# EAGLE board GBA SP schematic (EAGLE 7.6.0), part 1 of 2
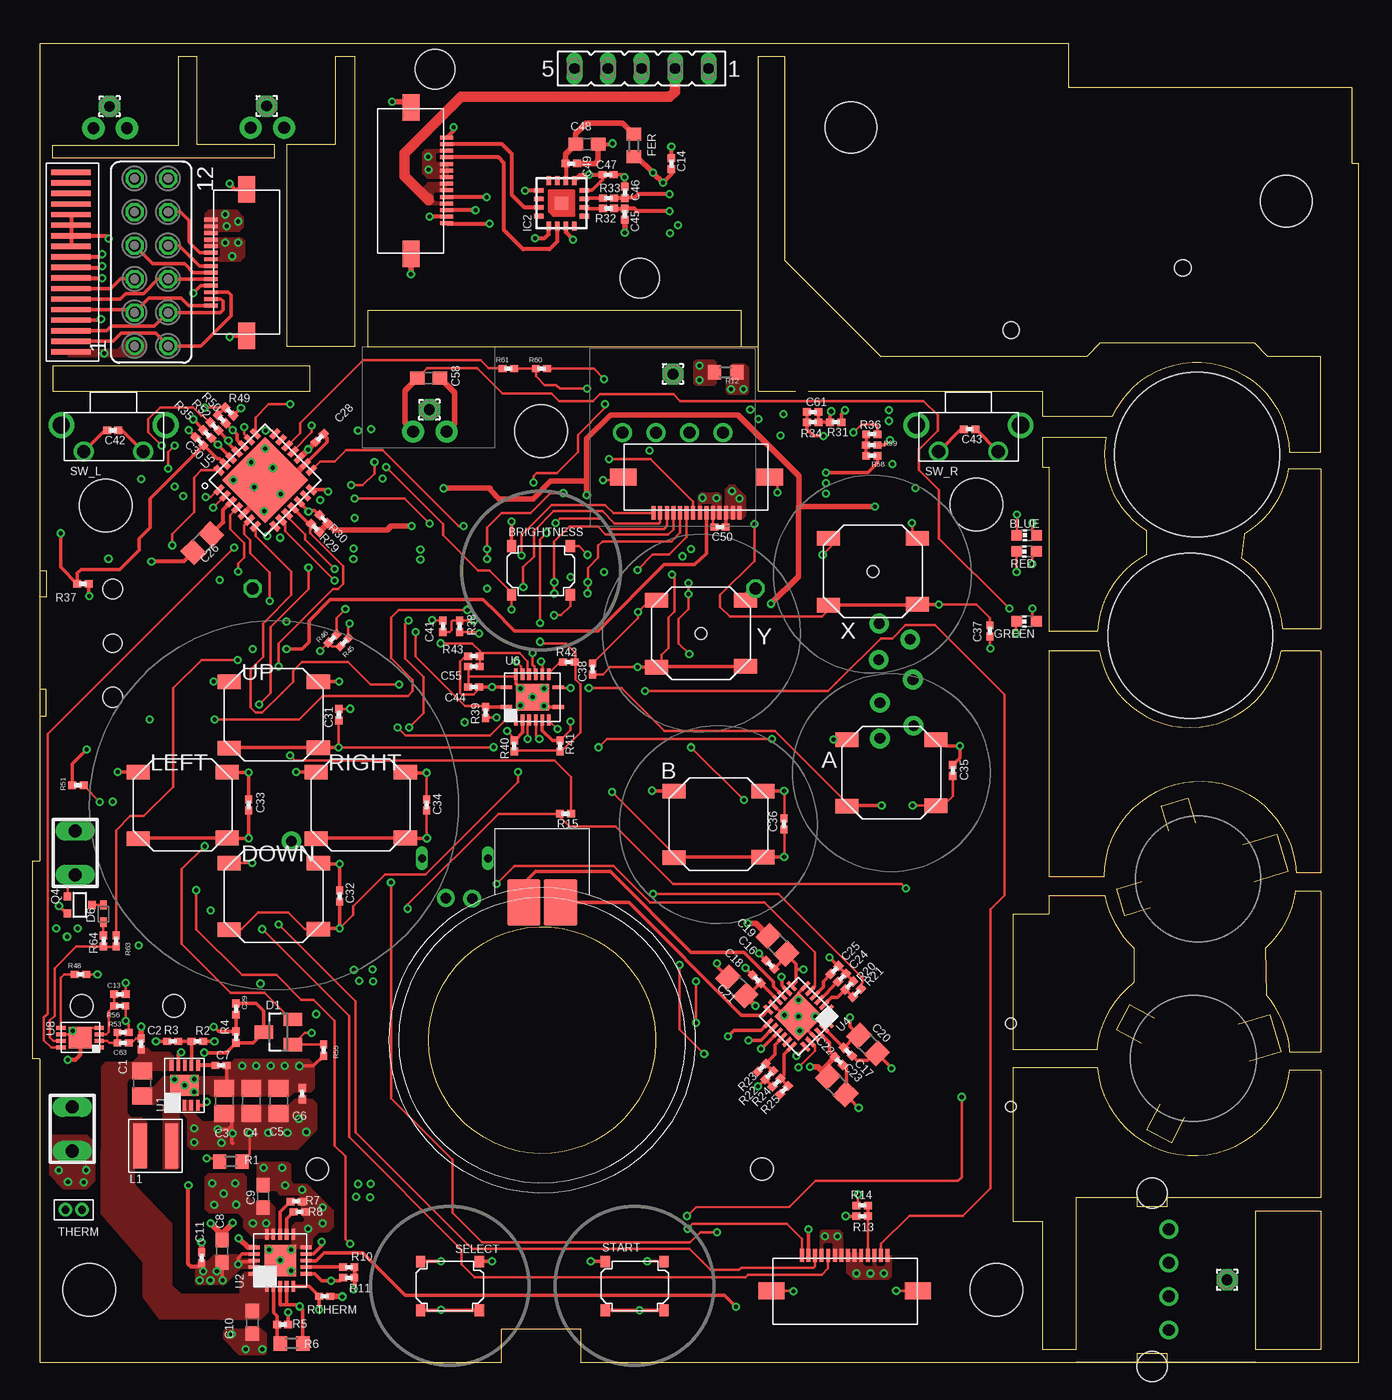
[diagram p10: board, top side]
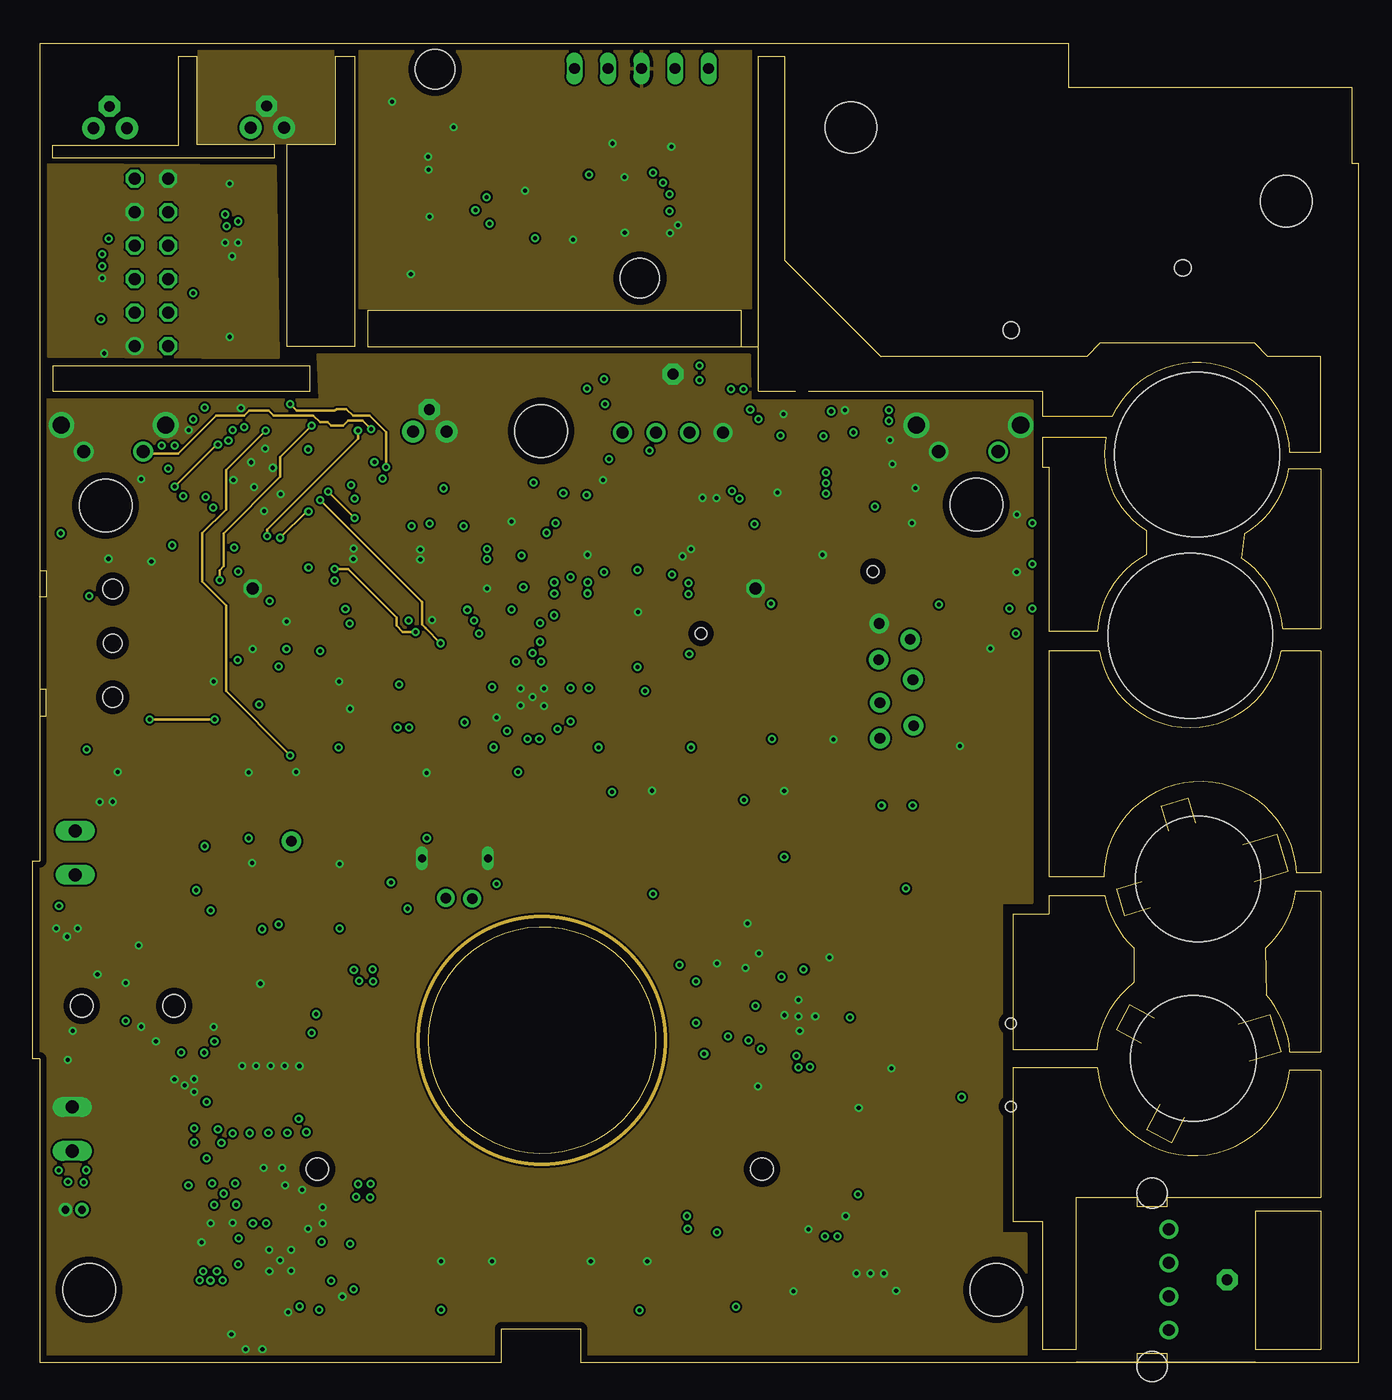
[diagram p11: board, inner layer Route2]
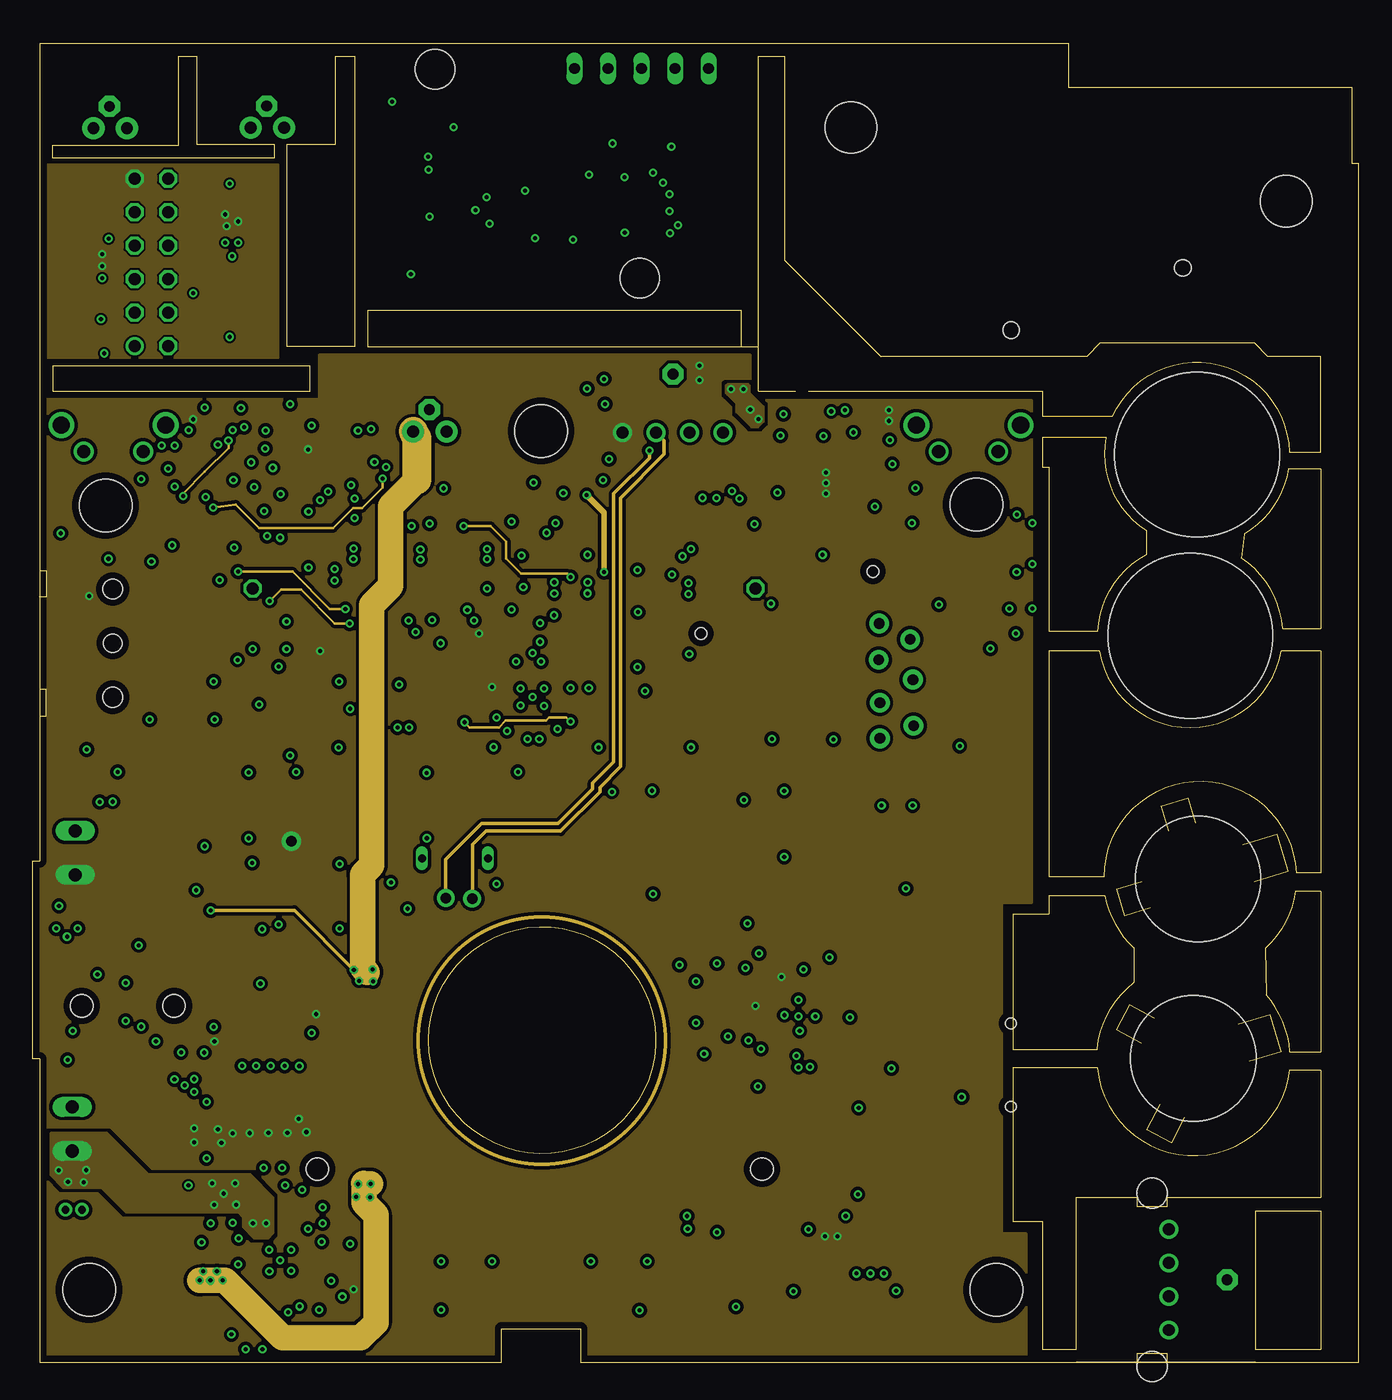
[diagram p12: board, inner layer Route15]
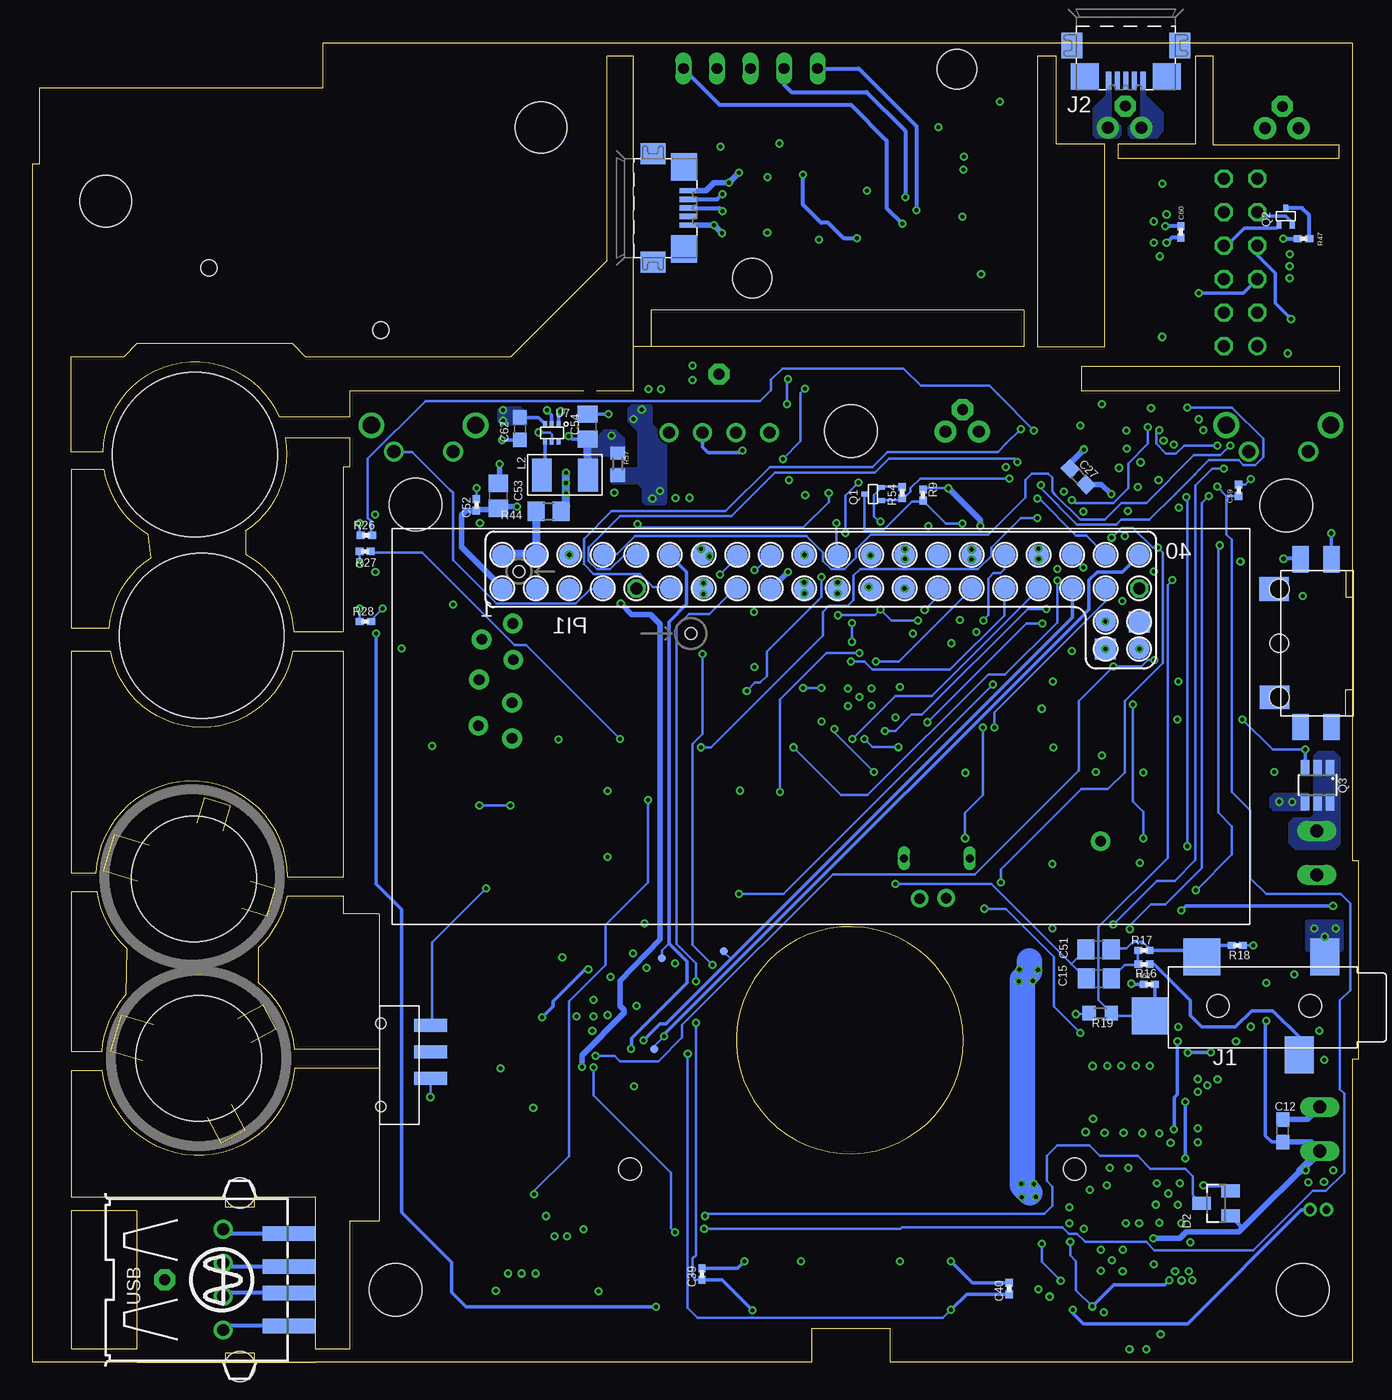
[diagram p13: board, bottom side, seen from below]

Size 100.5 x 100 mm. Coordinates in mm from the lower left corner, seen from the top.
Outline: 92.64,0 79.07,0
Outline: 0.5,0 35.5,0 35.5,2.55 41.5,2.55 41.5,0 100.5,0 100.5,90.85 100,90.85 100,96.6 78.5,96.6 78.5,100 0.5,100 0.5,38 0,38 0,23 0.5,23 0.5,0
Copper layers (1*2*15*16): Top 0.035mm / dielectric 0.2mm / Route2 0.035mm / dielectric 1.2mm / Route15 0.035mm / dielectric 0.2mm / Bottom 0.035mm
Design rules "Elecrow_4-layer_PCB_eagle_rule *": minimum track width 8mil, minimum drill 12mil, track to track 6mil, track to pad 6mil, pad to pad 6mil, via to via 8mil, smd to smd 0mil, copper to edge 20mil, drill to drill 10mil, minimum pad ring 6mil, minimum via ring 6mil, stop-mask expansion 0mil, vias tented up to drill 100mil, thermal gap 10mil
Holes 4 mm at 71.49,65.02 73.01,5.5 4.25,5.5 5.5,64.95 38.5,70.6
Holes 1.7 mm at 21.55,14.65 55.25,14.65
Holes 0.9 mm at 63.66,59.95 50.63,55.25
Holes 9.5 mm at 88.3,36.65 87.94,23.05
Holes 12.5 mm at 87.71,55.07 88.23,68.81
Holes 3.9 mm at 94.99,88.02 62,93.6
Holes 1.25 mm at 87.16,82.95 74.13,78.25
Holes 3 mm at 45.99,82.19 30.49,98.01
bKeepout: area 25,69.2 to 35,77; area 42.2,63.4 to 54.7,77
Milling: 128 lines

## Footprints (pad centres in the part's own frame; a part is rotated, then mirrored left to right if it is on the bottom)
GBA_SP_TACT = smd 1.75 x 1.1: 1 -3.37,2.5; 2 -3.37,-2.55; 3 3.38,2.5; 4 3.38,-2.5
HEADER-1X2 = drill 1 long: 1 -1.67,0; 2 1.67,0
CHIP-LED0603 = smd 0.8 x 0.8: A 0,-0.75; C 0,0.75
TL3315 = smd 0.7 x 0.9: 1 -2.225,1.85; 2 2.225,1.85; 3 -2.225,-1.85; 4 2.225,-1.85
C0805 = smd 1.3 x 1.5: 1 -0.95,0; 2 0.95,0
0402_REAL = smd 0.6 x 0.55: 1 -0.43,0.01; 2 0.42,0.01
C0603 = smd 1.1 x 1: 1 -0.85,0; 2 0.85,0
SOT23 = smd 1 x 1.4: 1 -0.95,-1.1; 2 0.95,-1.1; 3 0,1.1
SOD523 = smd 0.7 x 0.5: A 0.7,0; C -0.6,0
R0603 = smd 1 x 1.1: 1 -0.85,0; 2 0.85,0
QFN16 = smd 0.7 x 0.35: 1 -1.725,0.975; 2 -1.725,0.325; 3 -1.725,-0.325; 4 -1.725,-0.975; 9 1.725,-0.975; 10 1.725,-0.325; 11 1.725,0.325; 12 1.725,0.975 | smd 0.35 x 0.7: 5 -0.975,-1.725; 6 -0.325,-1.725; 7 0.325,-1.725; 8 0.975,-1.725; 13 0.975,1.725; 14 0.325,1.725; 15 -0.325,1.725; 16 -0.975,1.725 | smd 1 x 1: TAB 0,0
HEADPHONE_JACK = smd 2.2 x 2.8: 1 -4.64,-3.66; 3 -2.7,3.74 | smd 2.8 x 2.8: 2 4.69,-3.67; 4 8.59,0.79 | hole 1.7: -3.54,0.04; 3.46,0.04
MICRO_USB = smd 0.4 x 1.35: 1 -1.3,2.675; 2 -0.65,2.675; 3 0,2.675; 4 0.65,2.675; 5 1.3,2.675 | smd 1.6 x 1.9: M1 4.1,0; M2 -4.1,0 | smd 2.1 x 2: M3 -3.1,2.35; M4 3.1,2.35
USB_PWR_2PIN = drill 0.9 pad 1.676: 1 -1.27,0; 2 1.27,0
USB_4PIN = drill 0.9 pad 1.422: 1 -3.81,0; 2 -1.27,0; 3 1.27,0; 4 3.81,0
FPC_14 = smd 0.3 x 1: 1 -3.25,0; 2 -2.75,0; 3 -2.25,0; 4 -1.75,0; 5 -1.25,0; 6 -0.75,0; 7 -0.25,0; 8 0.25,0; 9 0.75,0; 10 1.25,0; 11 1.75,0; 12 2.25,0; 13 2.75,0; 14 3.25,0 | smd 2 x 1.3: PAD1 -5.55,-2.7; PAD2 5.55,-2.7
XFL4020-102MEB = smd 1 x 3.4: 1 -1.2,0; 2 1.2,0
L2520 = smd 1.5 x 2.5: 1 -0.5,0; 2 3,0
1,6/0,8 = drill 0.813 pad 1.6 octagon: 1 0,0
PI-ZERO = smd 1.6 x 1.6 bottom: 3.3V_1 56.64,25.45; 3.3V_2 36.3,25.45; 5V_1 56.64,27.99; 5V_2 54.07,27.99; BCM0 23.59,25.46; BCM1 23.61,28.01; BCM2_SDA 54.08,25.44; BCM3_SCL 51.55,25.45; BCM4 48.99,25.47; BCM5 21.07,25.47; BCM6 18.52,25.47; BCM7 26.14,28.01; BCM8 28.68,28; BCM9 31.22,25.45; BCM10 33.76,25.45; BCM11 28.69,25.45; BCM12 18.53,28.01; BCM13 16,25.48; BCM14 49,28; BCM15 46.46,28; BCM16 13.46,28.01; BCM17 43.92,25.46; BCM18 43.94,28; BCM19 13.45,25.48; BCM20 10.91,28.01; BCM21 8.36,28; BCM22 38.86,25.46; BCM23 38.85,27.99; BCM24 36.3,27.99; BCM25 31.22,27.99; BCM26 10.9,25.46; BCM27 41.4,25.46; GND1 10.92,22.96; GND2 8.37,20.89; GND4 26.14,25.46; GND6 51.57,28; GND7 41.4,28; GND8 33.75,28; GND9 21.07,28.01; GND10 16,28.01; RUN 8.37,22.93; TV 10.92,20.87 | drill 0.8 pad 1.5: 5V_FUSED 11.3,6.3; SD_CLK 58.4,18.55; SD_CMD 55.9,14.1; SD_DAT0 55.8,20.05; SD_DAT1 58.2,21.6; SD_DAT2 55.9,16.8; SD_DAT3 58.45,15.05; SD_GND 55.85,22.8 | drill 0.914 octagon: GND3 46.47,25.46; GND5 8.37,25.46 | drill 0.6 pad 0.8 long: GND_USB+ 21.2,5; GND_USB- 26.2,5 | drill 0.8 pad 1.35: USB+ 23,2; USB- 25,1.95
FE05-1 = drill 0.813 long: 1 -5.08,0; 2 -2.54,0; 3 0,0; 4 2.54,0; 5 5.08,0
SC75 = smd 0.356 x 0.508: D -0.01,0.59; G -0.51,-0.71; S 0.49,-0.71
TSOT23-6 = smd 0.62 x 1.22: 1 -0.95,-1.3; 2 0,-1.3; 3 0.95,-1.3; 4 0.95,1.3; 5 0,1.3; 6 -0.95,1.3
SC70 = smd 0.6 x 0.55: D 0,0.925; G -0.65,-0.925; S 0.65,-0.925
R0805 = smd 1.3 x 1.5: 1 -0.95,0; 2 0.95,0
SPI_SCREEN = smd 3 x 0.4: 1 0,0; 2 0,0.8; 3 0,1.6; 4 0,2.4; 5 0,3.2; 6 0,4; 7 0,4.8; 8 0,5.6; 9 0,6.4; 10 0,7.2; 11 0,8; 12 0,8.8; 13 0,9.6; 14 0,10.4; 15 0,11.2; 16 0,12; 17 0,12.8; 18 0,13.6
GBA-SPKR = smd 2.5 x 3.5: SPKR+ -1.4,10.4; SPKR- 1.4,10.4
FE06-2 = drill 0.914: 1 -6.35,1.27 | drill 0.914 octagon: 2 -6.35,-1.27; 3 -3.81,1.27; 4 -3.81,-1.27; 5 -1.27,1.27; 6 -1.27,-1.27; 7 1.27,1.27; 8 1.27,-1.27; 9 3.81,1.27; 10 3.81,-1.27; 11 6.35,1.27; 12 6.35,-1.27
GBA-SHOULDER-SW = drill 1: A -2.25,0; B 2.25,0 | drill 1.3: GND1 -3.95,2; GND2 3.95,2
DF13-2_THIN = drill 0.6 pad 1.016: 1 -0.63,0; 2 0.62,0
TP06R = smd 0.6 x 0.6: TP 0,0
VSON10 = smd 0.825 x 0.28: 1 -1.5,1; 2 -1.5,0.5; 3 -1.5,0; 4 -1.5,-0.5; 5 -1.5,-1; 6 1.525,-1.025; 7 1.525,-0.525; 8 1.525,-0.025; 9 1.525,0.475; 10 1.525,0.975 | smd 1.6 x 2.15: GND 0,0.025
QFN20 = smd 0.85 x 0.28: 1 -1.97,1; 2 -1.97,0.5; 3 -1.97,0; 4 -1.97,-0.5; 5 -1.97,-1; 11 1.98,-1; 12 1.98,-0.5; 13 1.98,0; 14 1.98,0.5; 15 1.98,1 | smd 0.28 x 0.85: 6 -1.01,-1.98; 7 -0.51,-1.98; 8 -0.01,-1.98; 9 0.49,-1.98; 10 0.99,-1.98; 16 0.99,1.97; 17 0.49,1.97; 18 -0.01,1.97; 19 -0.51,1.97; 20 -1.01,1.97 | smd 2.4 x 2.4: PAD 0,-0.01
QFN24 = smd 0.85 x 0.28: 1 -1.98,1.25; 2 -1.98,0.75; 3 -1.98,0.25; 4 -1.98,-0.25; 5 -1.98,-0.75; 6 -1.98,-1.25; 13 1.98,-1.25; 14 1.98,-0.75; 15 1.98,-0.25; 16 1.98,0.25; 17 1.98,0.75; 18 1.98,1.25 | smd 0.28 x 0.85: 7 -1.25,-1.98; 8 -0.75,-1.98; 9 -0.25,-1.98; 10 0.25,-1.98; 11 0.75,-1.98; 12 1.25,-1.98; 19 1.25,1.98; 20 0.75,1.98; 21 0.25,1.98; 22 -0.25,1.98; 23 -0.75,1.98; 24 -1.25,1.98 | smd 2.6 x 2.6: PAD 0,0
QFN-S_28 = smd 0.85 x 0.4: 1 -3,1.95; 2 -3,1.3; 3 -3,0.65; 4 -3,0; 5 -3,-0.65; 6 -3,-1.3; 7 -3,-1.95; 15 3,-1.95; 16 3,-1.3; 17 3,-0.65; 18 3,0; 19 3,0.65; 20 3,1.3; 21 3,1.95 | smd 0.4 x 0.85: 8 -1.95,-3; 9 -1.3,-3; 10 -0.65,-3; 11 0,-3; 12 0.65,-3; 13 1.3,-3; 14 1.95,-3; 22 1.95,3; 23 1.3,3; 24 0.65,3; 25 0,3; 26 -0.65,3; 27 -1.3,3; 28 -1.95,3 | smd 4.6 x 4.6: PAD 0,0
VQFN16 = smd 0.85 x 0.28: 1 -1.97,-0.75; 8 1.97,-0.75; 9 1.97,0.75; 16 -1.97,0.75 | smd 0.28 x 0.85: 2 -1.25,-1.73; 3 -0.75,-1.73; 4 -0.25,-1.73; 5 0.25,-1.73; 6 0.75,-1.73; 7 1.25,-1.73; 10 1.25,1.73; 11 0.75,1.73; 12 0.25,1.73; 13 -0.25,1.73; 14 -0.75,1.73; 15 -1.25,1.73 | smd 2.5 x 2: PAD 0,0
SOT-563 = smd 0.3 x 0.45: 1 -0.5,-0.675; 2 0,-0.675; 3 0.5,-0.675; 4 0.5,0.675; 5 0,0.675; 6 -0.5,0.675
TDFN-2X3 = smd 0.7 x 0.3: 1 -1.45,0.75; 2 -1.45,0.25; 3 -1.45,-0.25; 4 -1.45,-0.75; 5 1.45,-0.75; 6 1.45,-0.25; 7 1.45,0.25; 8 1.45,0.75 | smd 1.75 x 1.63: EP 0,0
CSS-1210 = smd 1 x 2.5: 1 -3,3.85; 2 -1,3.85; 3 1,3.85 | hole 0.8: -3.15,0.1; 3.15,0.1
GBA-POT = smd 1.8 x 2.25: GND1 1.4,-0.5; GND2 9.6,-0.45 | smd 2 x 1.25: GND3 11.85,1.5; GND4 11.85,3.85; POT1 -0.85,3.85; POT2 -0.85,1.5 | hole 1.4: 5.5,-0.1 | hole 1.5: 1.4,-0.1; 9.6,-0.1
USB-A003 = smd 1.12 x 4: 1 -3.5,14; 2 -1,14; 3 1,14; 4 3.5,14 | hole 2.3: -6.57,10.28; 6.57,10.28

## Placement (x,y rotation side)
A  TACTILEGBA_SP  [GBA_SP_TACT]  65.05,44.7 0 top
B  TACTILEGBA_SP  [GBA_SP_TACT]  51.95,40.8 0 top
BATT  DNP  [HEADER-1X2]  2.97,17.69 90 top
BLUE  [CHIP-LED0603]  75.31,62.69 90 top
BRIGHTNESS  TACTILE  [TL3315]  38.5,60.03 0 top
C1  22uF  [C0805]  8.28,21.15 270 top
C2  0.1uF  [0402_REAL]  8.22,24.15 90 top
C3  22uF  [C0805]  14.5,19.83 90 top
C4  22uF  [C0805]  16.56,19.83 90 top
C5  22uF  [C0805]  18.63,19.83 90 top
C6  0.1uF  [0402_REAL]  20.42,20.38 90 top
C7  10nF  [0402_REAL]  14.26,22.51 0 top
C8  4.7uF  [C0603]  14.34,8.43 90 top
C9  4.7uF  [C0603]  17.45,12.59 90 top
C10  4.7uF  [C0603]  16.63,3.03 270 top
C11  0.1uF  [0402_REAL]  12.8,7.94 90 top
C12  4.7uF  [C0603]  5.78,17.56 90 bottom
C13  0.1uF  [0402_REAL]  6.6,27.9 0 top
C14  0.1uF  [0402_REAL]  48.39,90.86 90 top
C15  47uF  [C0805]  19.72,29.1 0 bottom
C16  0.1uF  [0402_REAL]  55.88,30.15 135 top
C17  0.1uF  [0402_REAL]  61.76,23.54 315 top
C18  0.1uF  [0402_REAL]  54.85,29.07 135 top
C19  22uF  [C0805]  56.43,31.66 135 top
C20  22uF  [C0805]  63.28,24.09 315 top
C21  22uF  [C0805]  53.34,28.5 135 top
C22  0.1uF  [0402_REAL]  61.08,22.84 315 top
C23  22uF  [C0805]  60.93,20.98 315 top
C24  0.1uF  [0402_REAL]  61.32,29.16 45 top
C25  0.1uF  [0402_REAL]  60.76,29.74 45 top
C26  22uF  [C0805]  12.83,62.09 225 top
C27  4.7uF  [C0603]  21.28,67.13 315 bottom
C28  0.1uF  [0402_REAL]  21.74,70.08 45 top
C29  0.1uF  [0402_REAL]  15.38,26.78 270 top
C30  0.1uF  [0402_REAL]  12.63,69.83 135 top
C31  0.1uF  [0402_REAL]  23.19,49.09 90 top
C32  0.1uF  [0402_REAL]  23.25,35.35 90 top
C33  0.1uF  [0402_REAL]  16.35,42.25 90 top
C34  0.1uF  [0402_REAL]  29.84,42.26 90 top
C35  0.1uF  [0402_REAL]  69.72,44.87 90 top
C36  0.1uF  [0402_REAL]  56.92,40.81 90 top
C37  0.1uF  [0402_REAL]  72.52,55.44 270 top
C38  0.1uF  [0402_REAL]  42.41,52.57 90 top
C39  0.1uF  [0402_REAL]  49.79,6.7 90 bottom
C40  0.1uF  [0402_REAL]  26.51,5.61 90 bottom
C41  0.1uF  [0402_REAL]  31.08,55.8 90 top
C42  0.1uF  [0402_REAL]  6.04,70.65 180 top
C43  0.1uF  [0402_REAL]  70.99,70.73 180 top
C44  0.1uF  [0402_REAL]  33.39,51.2 180 top
C45  33pF  [0402_REAL]  44.85,87.02 270 top
C46  33pF  [0402_REAL]  44.87,88.68 90 top
C47  0.1uF  [0402_REAL]  43.59,90.01 0 top
C48  4.7uF  [C0603]  41.98,92.33 0 top
C49  0.1uF  [0402_REAL]  40.8,90.86 0 top
C50  0.1uF  [0402_REAL]  52.06,63.33 180 top
C51  DNP  [C0805]  19.74,31.3 0 bottom
C52  0.1uF  [0402_REAL]  66.88,65 90 bottom
C53  22uF  [C0805]  65.23,65.68 90 bottom
C54  22uF  [C0805]  58.48,70.93 90 bottom
C55  0.1uF  [0402_REAL]  33.41,52.76 180 top
C58  4.7uF  [C0603]  29.99,74.6 0 top
C59  0.1uF  [0402_REAL]  9.11,66.1 90 bottom
C60  0.1uF  [0402_REAL]  13.52,85.68 270 bottom
C61  6.8pF  [0402_REAL]  59.1,72.03 0 top
C62  4.7uF  [C0603]  63.6,70.77 270 bottom
C63  1uF  [0402_REAL]  6.83,24.21 0 top
D1  BAS70-05  [SOT23]  18.59,25.04 90 top
D2  BAS70-05  [SOT23]  10.84,12.06 90 bottom
D6  [SOD523]  5.33,33.97 90 top
DOWN  TACTILEGBA_SP  [GBA_SP_TACT]  18.25,35.35 0 top
FAN  DNP  [HEADER-1X2]  3.2,38.62 90 top
FER  0  [R0603]  45.54,92.23 90 top
GREEN  [CHIP-LED0603]  75.3,56.16 90 top
IC2  FT230XQ  [QFN16]  40.06,87.85 90 top
J1  DNP  [HEADPHONE_JACK]  7.23,27.06 180 bottom
J2  MICRO_USB  [MICRO_USB]  17.67,99.81 180 bottom
J4  DNP  [USB_PWR_2PIN]  30.09,70.56 0 top
J5  DNP  [USB_4PIN]  48.49,70.48 0 top
J6  FPC_14  [FPC_14]  31.35,89.58 270 top
J7  FPC_14  [FPC_14]  61.52,8.12 0 top
J8  DNP  [USB_4PIN]  86.08,6.27 270 top
J9  DNP  [USB_PWR_2PIN]  5.85,93.55 0 top
J11  Debug USB  [MICRO_USB]  53.51,87.5 270 bottom
J12  FPC_14  [FPC_14]  50.29,64.4 180 top
J13  DNP  [USB_PWR_2PIN]  17.76,93.57 0 top
J14  FPC_14  [FPC_14]  13.49,83.35 90 top
L1  74405042010  [XFL4020-102MEB]  9.31,16.42 0 top
L2  2.2uH  [L2520]  61.43,67.27 0 bottom
LEFT  TACTILEGBA_SP  [GBA_SP_TACT]  11.35,42.25 0 top
MICRO_PAD1  DNP  [1,6/0,8]  30.04,72.21 0 top
MICRO_PAD2  DNP  [1,6/0,8]  17.71,95.22 0 top
MICRO_PAD4  DNP  [1,6/0,8]  5.8,95.2 0 top
PI1  DNP  [PI-ZERO]  8.29,33.2 0 top
PIC_PROGRAMMING  DNP  [FE05-1]  46.12,98.06 180 top
Q1  NMOSSC75  [SC75]  36.88,65.83 90 bottom
Q2  NMOSSC75  [SC75]  5.54,86.9 0 bottom
Q3  DNP  [TSOT23-6]  3.14,43.76 180 bottom
Q4  PMOS  [SC70]  3.54,34.68 270 top
R1  220k  [R0603]  15,15.24 0 top
R2  402k  [0402_REAL]  12.47,24.32 0 top
R3  100k  [0402_REAL]  10.59,24.32 0 top
R4  100k  [0402_REAL]  15.38,24.65 270 top
R5  100k  [0402_REAL]  18.91,2.88 180 top
R6  270k  [R0603]  19.6,1.45 0 top
R7  2k  [0402_REAL]  19.94,12.21 180 top
R8  100k  [0402_REAL]  20.18,11.42 180 top
R9  10k  [0402_REAL]  33.05,65.73 270 bottom
R10  100k  [0402_REAL]  23.94,7.22 0 top
R11  100k  [0402_REAL]  23.94,6.42 0 top
R12  DNP  [R0603]  52.5,75.04 180 top
R13  3.3k  [0402_REAL]  62.85,11.08 0 top
R14  2k  [0402_REAL]  62.84,11.9 180 top
R15  10k  [0402_REAL]  40.35,41.59 180 top
R16  0  [0402_REAL]  16.29,30.17 0 bottom
R17  0  [0402_REAL]  16.29,31.22 0 bottom
R18  10k  [0402_REAL]  9.23,31.62 180 bottom
R19  220k  [R0603]  19.61,26.47 180 bottom
R20  3.3k  [0402_REAL]  61.86,28.58 225 top
R21  2k  [0402_REAL]  62.45,28.01 45 top
R22  3.3k  [0402_REAL]  55.81,21.78 45 top
R23  2k  [0402_REAL]  55.22,22.35 225 top
R24  3.3k  [0402_REAL]  56.36,21.21 45 top
R25  2k  [0402_REAL]  56.91,20.64 225 top
R26  2k  [0402_REAL]  75.23,62.68 0 bottom
R27  2k  [0402_REAL]  75.32,61.46 0 bottom
R28  1k  [0402_REAL]  75.3,56.15 0 bottom
R29  2k  [0402_REAL]  21.39,63.25 135 top
R30  2k  [0402_REAL]  22.03,63.93 135 top
R31  100k  [0402_REAL]  60.83,71.26 180 top
R32  22  [0402_REAL]  43.61,87.47 180 top
R33  22  [0402_REAL]  43.61,88.25 180 top
R34  442k  [0402_REAL]  59.09,71.26 180 top
R35  10k  [0402_REAL]  13.2,70.36 315 top
R36  10k  [0402_REAL]  63.57,70.36 180 top
R37  10k  [0402_REAL]  3.78,59.02 180 top
R38  10k  [0402_REAL]  32.34,55.8 90 top
R39  10k  [0402_REAL]  34.29,49.25 270 top
R40  DNP  [0402_REAL]  36.47,46.72 270 top
R41  DNP  [0402_REAL]  39.94,46.71 270 top
R42  DNP  [0402_REAL]  40.61,53.07 0 top
R43  10k  [0402_REAL]  33.41,53.53 180 top
R44  0  [R0805]  61.42,64.51 0 bottom
R45  10k  [0402_REAL]  23.61,54.57 45 top
R46  10k  [0402_REAL]  22.71,54.86 45 top
R47  22  [0402_REAL]  4.2,85.16 0 bottom
R48  DNP  [0402_REAL]  3.6,29.4 0 top
R49  3.3k  [0402_REAL]  14.88,72.08 135 top
R50  2k  [0402_REAL]  14.31,71.48 315 top
R51  10k  [0402_REAL]  3.41,43.74 0 top
R52  2k  [0402_REAL]  13.75,70.92 315 top
R53  1k  [0402_REAL]  6.82,25.02 180 top
R54  10k  [0402_REAL]  34.62,65.92 90 bottom
R55  100k  [0402_REAL]  22.03,23.67 90 top
R56  150  [0402_REAL]  6.59,27.02 0 top
R57  0  [R0603]  56.19,68.08 270 bottom
R58  0  [0402_REAL]  63.57,68.73 180 top
R59  DNP  [0402_REAL]  63.57,69.51 0 top
R60  DNP  [0402_REAL]  38.54,75.31 0 top
R61  0  [0402_REAL]  36.03,75.32 0 top
R62  DNP  [0402_REAL]  15.88,28.64 0 bottom
R63  1k  [0402_REAL]  6.32,31.95 90 top
R64  499  [0402_REAL]  5.36,31.95 90 top
RED  [CHIP-LED0603]  75.3,61.47 90 top
RIGHT  TACTILEGBA_SP  [GBA_SP_TACT]  24.84,42.25 0 top
RTHERM  10k  [0402_REAL]  22.1,5.03 180 top
SCREEN1  DNP  [SPI_SCREEN]  2.89,76.59 0 top
SELECT  TACTILE  [TL3315]  31.6,5.8 0 top
SPKR  DNP  [GBA-SPKR]  38.59,24.45 0 top
START  TACTILE  [TL3315]  45.6,5.8 0 top
SV1  DNP  [FE06-2]  8.97,83.38 90 top
SW_L  DNP  [GBA-SHOULDER-SW]  6.1,69.04 0 top
SW_R  DNP  [GBA-SHOULDER-SW]  70.9,69.03 0 top
THERM  DNP  [DF13-2_THIN]  3.08,11.57 180 top
TP1  TPTP06R  [TP06R]  48.14,31.17 0 bottom
TP2  TPTP06R  [TP06R]  53.42,23.75 0 bottom
TP3  TPTP06R  [TP06R]  52.83,30.63 0 bottom
U1  TPS61230  [VSON10]  11.49,20.99 90 top
U2  MCP73871  [QFN20]  18.73,7.73 90 top
U4  TAS2521  [QFN24]  58.03,26.23 225 top
U5  PIC18F25K80  [QFN-S_28]  17.6,66.88 45 top
U6  SN74CBT3257C  [VQFN16]  37.85,50.42 0 top
U7  TLV62568  [SOT-563]  61.18,70.45 180 bottom
U8  MAX17040  [TDFN-2X3]  3.57,24.62 180 top
U$1  CSS-1210  [CSS-1210]  74.23,22.54 270 bottom
U$2  DNP  [GBA-POT]  5.94,60.01 270 bottom
UP  TACTILEGBA_SP  [GBA_SP_TACT]  18.25,49.1 0 top
USB_PAD  DNP  [1,6/0,8]  48.5,74.91 0 top
USB_PAD1  DNP  [1,6/0,8]  90.51,6.26 270 top
X  [GBA_SP_TACT]  63.66,59.95 0 top
X1  DNP  [USB-A003]  95.1,6.26 270 bottom
Y  [GBA_SP_TACT]  50.63,55.25 0 top